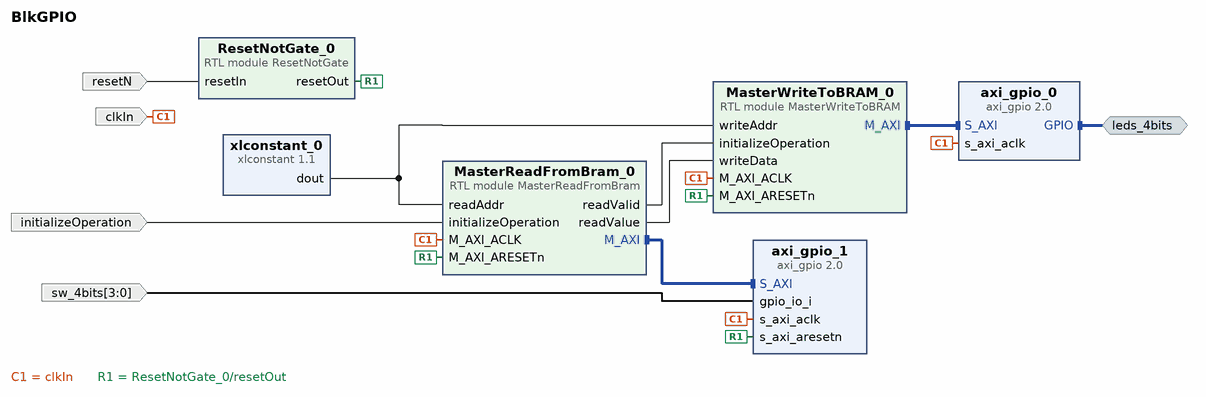
[diagram p0: block diagram of the top level]
# Vivado block design BlkGPIO, xc7z010clg400-1, Vivado 2019.1
create_bd_design BlkGPIO

create_bd_intf_port -mode Master -vlnv xilinx.com:interface:gpio_rtl:1.0 leds_4bits
create_bd_port -dir I clkIn
create_bd_port -dir I resetN
create_bd_port -dir I initializeOperation
create_bd_port -dir I -from 3 -to 0 sw_4bits

create_bd_cell -type ip -vlnv xilinx.com:ip:axi_gpio:2.0 axi_gpio_0
set_property -dict {CONFIG.GPIO_BOARD_INTERFACE Custom CONFIG.USE_BOARD_FLOW true} [get_bd_cells axi_gpio_0]
create_bd_cell -type ip -vlnv xilinx.com:ip:xlconstant:1.1 xlconstant_0
set_property -dict {CONFIG.CONST_VAL 0 CONFIG.CONST_WIDTH 32} [get_bd_cells xlconstant_0]
create_bd_cell -type module -reference MasterWriteToBRAM MasterWriteToBRAM_0
create_bd_cell -type module -reference ResetNotGate ResetNotGate_0
create_bd_cell -type ip -vlnv xilinx.com:ip:axi_gpio:2.0 axi_gpio_1
set_property -dict {CONFIG.C_ALL_INPUTS 1 CONFIG.C_GPIO_WIDTH 4} [get_bd_cells axi_gpio_1]
create_bd_cell -type module -reference MasterReadFromBram MasterReadFromBram_0

# ---- connections ----

connect_bd_intf_net [get_bd_intf_pins axi_gpio_0/S_AXI] [get_bd_intf_pins MasterWriteToBRAM_0/M_AXI]
connect_bd_intf_net [get_bd_intf_pins MasterReadFromBram_0/M_AXI] [get_bd_intf_pins axi_gpio_1/S_AXI]
connect_bd_intf_net [get_bd_intf_ports leds_4bits] [get_bd_intf_pins axi_gpio_0/GPIO]
connect_bd_net -net clk_wiz_clk_out1 [get_bd_ports clkIn] \
  [get_bd_pins axi_gpio_0/s_axi_aclk] [get_bd_pins MasterWriteToBRAM_0/M_AXI_ACLK] [get_bd_pins axi_gpio_1/s_axi_aclk] \
  [get_bd_pins MasterReadFromBram_0/M_AXI_ACLK]
connect_bd_net [get_bd_pins xlconstant_0/dout] [get_bd_pins MasterWriteToBRAM_0/writeAddr] [get_bd_pins MasterReadFromBram_0/readAddr]
connect_bd_net [get_bd_ports resetN] [get_bd_pins ResetNotGate_0/resetIn]
connect_bd_net [get_bd_pins ResetNotGate_0/resetOut] \
  [get_bd_pins MasterWriteToBRAM_0/M_AXI_ARESETn] [get_bd_pins axi_gpio_1/s_axi_aresetn] \
  [get_bd_pins MasterReadFromBram_0/M_AXI_ARESETn]
connect_bd_net [get_bd_ports sw_4bits] [get_bd_pins axi_gpio_1/gpio_io_i]
connect_bd_net [get_bd_ports initializeOperation] [get_bd_pins MasterReadFromBram_0/initializeOperation]
connect_bd_net [get_bd_pins MasterReadFromBram_0/readValid] [get_bd_pins MasterWriteToBRAM_0/initializeOperation]
connect_bd_net [get_bd_pins MasterReadFromBram_0/readValue] [get_bd_pins MasterWriteToBRAM_0/writeData]

# ---- address map ----
assign_bd_address -offset 0x40000000 -range 64K -target_address_space [get_bd_addr_spaces MasterReadFromBram_0/M_AXI] [get_bd_addr_segs axi_gpio_1/S_AXI/Reg]
assign_bd_address -offset 0x40000000 -range 64K -target_address_space [get_bd_addr_spaces MasterWriteToBRAM_0/M_AXI] [get_bd_addr_segs axi_gpio_0/S_AXI/Reg]

validate_bd_design
save_bd_design
